# Altium schematic sheet NeuroPico Hub.SchDoc
size 297 x 209 mm; CompanyName: Sainsbury Wellcome Centre; Organization: FabLab; Address1: Sainsbury Wellcome Centre; Address2: 25 Howland Street; Address3: London; Address4: W1T 4JG; DocumentNumber: 1; SheetNumber: 1; SheetTotal: 14; swcgroup: FabLab; Org: Sainsbury Wellcome Centre; Add1: 25 Howland Street; Add2: London; Add3: W1T 4JG; WebAddress: www.sainsburywellcome.org; SheetSize: A4; SheetName: NeuroPico Hub
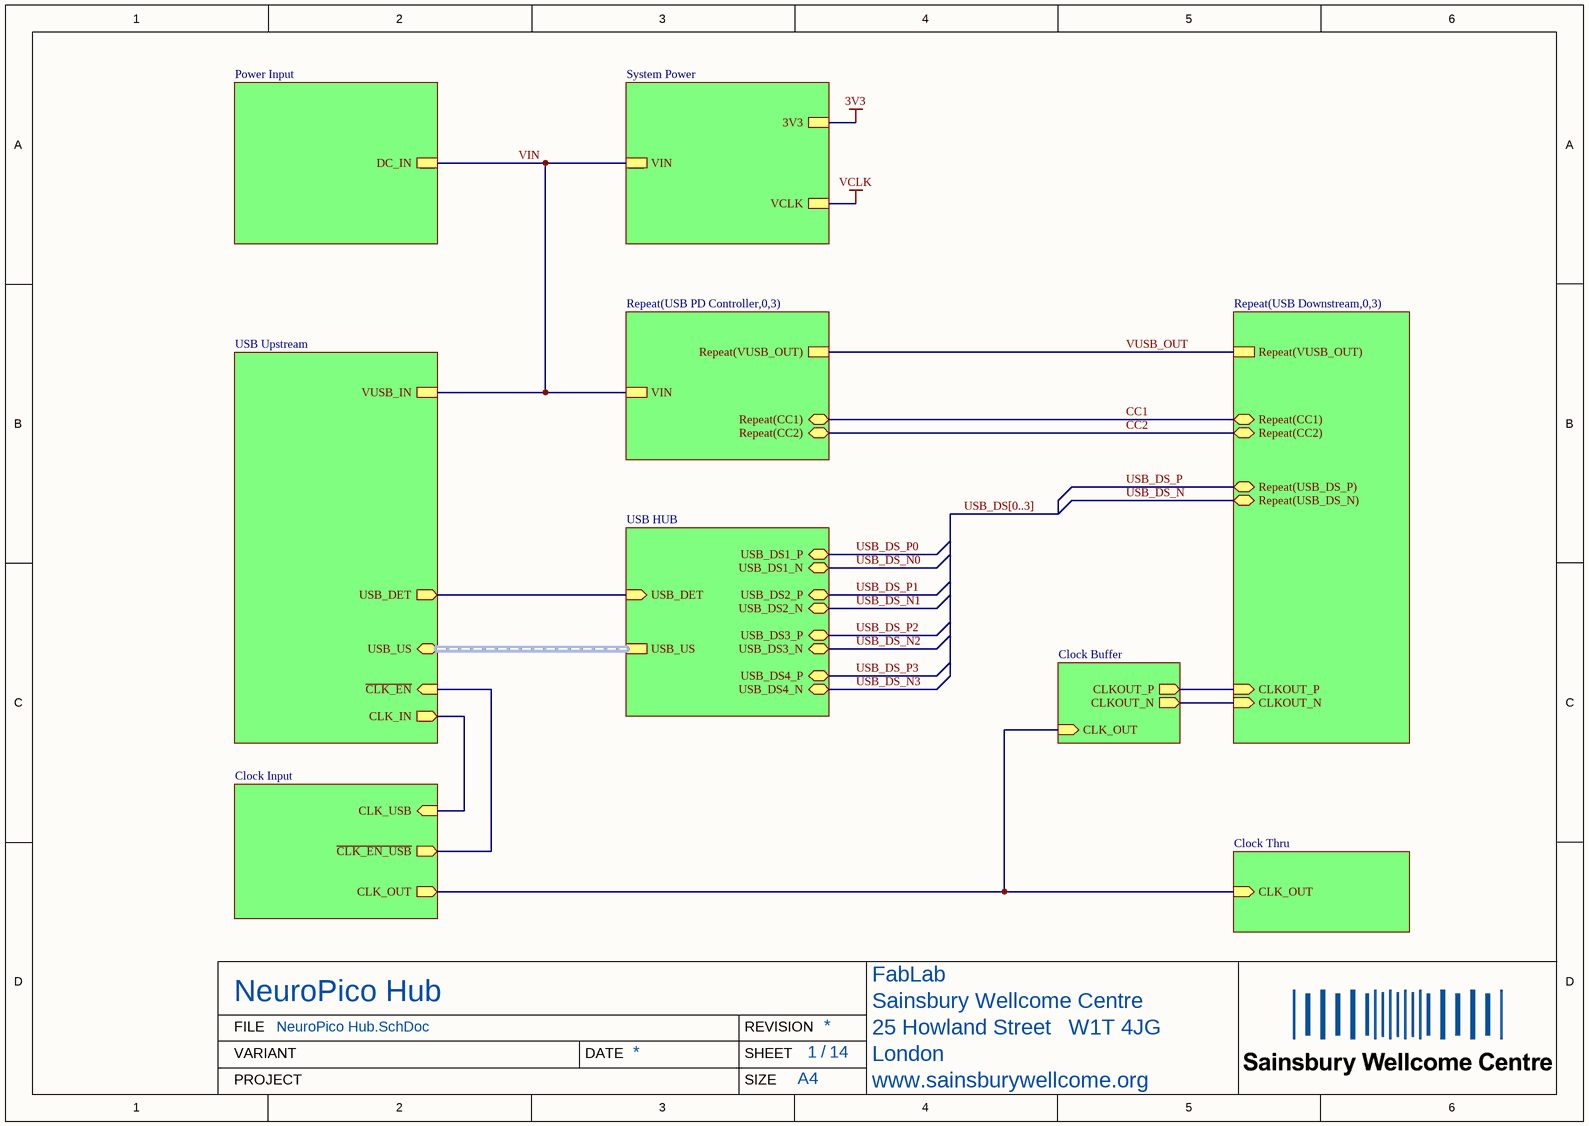
[diagram p0: NeuroPico Hub.SchDoc]

## Sub-sheets
Clock Buffer = Clock Buffer.SchDoc: CLK_OUT (in), CLKOUT_P (out), CLKOUT_N (out)
Clock Input = Clock Input.SchDoc: CLK_OUT (out), CLK_USB (in), ~{CLK_EN_USB} (out)
Clock Thru = Clock Thru.SchDoc: CLK_OUT (in)
Power Input = Power Input.SchDoc: DC_IN
Repeat(USB Downstream,0,3) = USB Downstream.SchDoc: CLKOUT_P (in), CLKOUT_N (in), Repeat(USB_DS_P) (bidir), Repeat(USB_DS_N) (bidir), Repeat(CC1) (bidir), Repeat(CC2) (bidir), Repeat(VUSB_OUT)
Repeat(USB PD Controller,0,3) = USB PD Controller.SchDoc: VIN, Repeat(CC1) (bidir), Repeat(CC2) (bidir), Repeat(VUSB_OUT)
System Power = System Power.SchDoc: VIN, 3V3, VCLK
USB HUB = USB HUB.SchDoc: USB_DS1_N (bidir), USB_DS1_P (bidir), USB_DS2_N (bidir), USB_DS2_P (bidir), USB_DS3_P (bidir), USB_DS3_N (bidir), USB_US (harness USB_US), USB_DS4_P (bidir), USB_DS4_N (bidir), USB_DET (in)
USB Upstream = USB Upstream.SchDoc: USB_US (bidir, harness USB_US), VUSB_IN, CLK_IN (out), ~{CLK_EN} (in), USB_DET (out)

## Nets
3V3: sheet System Power/3V3
VCLK: sheet System Power/VCLK
CC1: sheet Repeat(USB Downstream,0,3)/Repeat(CC1), sheet Repeat(USB PD Controller,0,3)/Repeat(CC1)
CC2: sheet Repeat(USB Downstream,0,3)/Repeat(CC2), sheet Repeat(USB PD Controller,0,3)/Repeat(CC2)
USB_DS_N: sheet Repeat(USB Downstream,0,3)/Repeat(USB_DS_N)
USB_DS_N0: sheet USB HUB/USB_DS1_N
USB_DS_N1: sheet USB HUB/USB_DS2_N
USB_DS_N2: sheet USB HUB/USB_DS3_N
USB_DS_N3: sheet USB HUB/USB_DS4_N
USB_DS_P: sheet Repeat(USB Downstream,0,3)/Repeat(USB_DS_P)
USB_DS_P0: sheet USB HUB/USB_DS1_P
USB_DS_P1: sheet USB HUB/USB_DS2_P
USB_DS_P2: sheet USB HUB/USB_DS3_P
USB_DS_P3: sheet USB HUB/USB_DS4_P
VIN: sheet System Power/VIN, sheet Power Input/DC_IN, sheet USB Upstream/VUSB_IN, sheet Repeat(USB PD Controller,0,3)/VIN
VUSB_OUT: sheet Repeat(USB Downstream,0,3)/Repeat(VUSB_OUT), sheet Repeat(USB PD Controller,0,3)/Repeat(VUSB_OUT)
(unnamed): sheet Repeat(USB Downstream,0,3)/CLKOUT_P, sheet Clock Buffer/CLKOUT_P
(unnamed): sheet Repeat(USB Downstream,0,3)/CLKOUT_N, sheet Clock Buffer/CLKOUT_N
(unnamed): sheet Clock Input/CLK_OUT, sheet Clock Thru/CLK_OUT, sheet Clock Buffer/CLK_OUT
(unnamed): sheet Clock Input/CLK_USB, sheet USB Upstream/CLK_IN
(unnamed): sheet Clock Input/~{CLK_EN_USB}, sheet USB Upstream/~{CLK_EN}
(unnamed): sheet USB Upstream/USB_DET, sheet USB HUB/USB_DET

## Buses and harness runs
bus USB_DS[0..3]
harness sheet USB HUB/USB_US = sheet USB Upstream/USB_US

## Notes on the sheet
- FILE
- VARIANT
- DATE
- REVISION
- SHEET
- /
- PROJECT
- SIZE